# Altium project Ethernet.PrjPCB
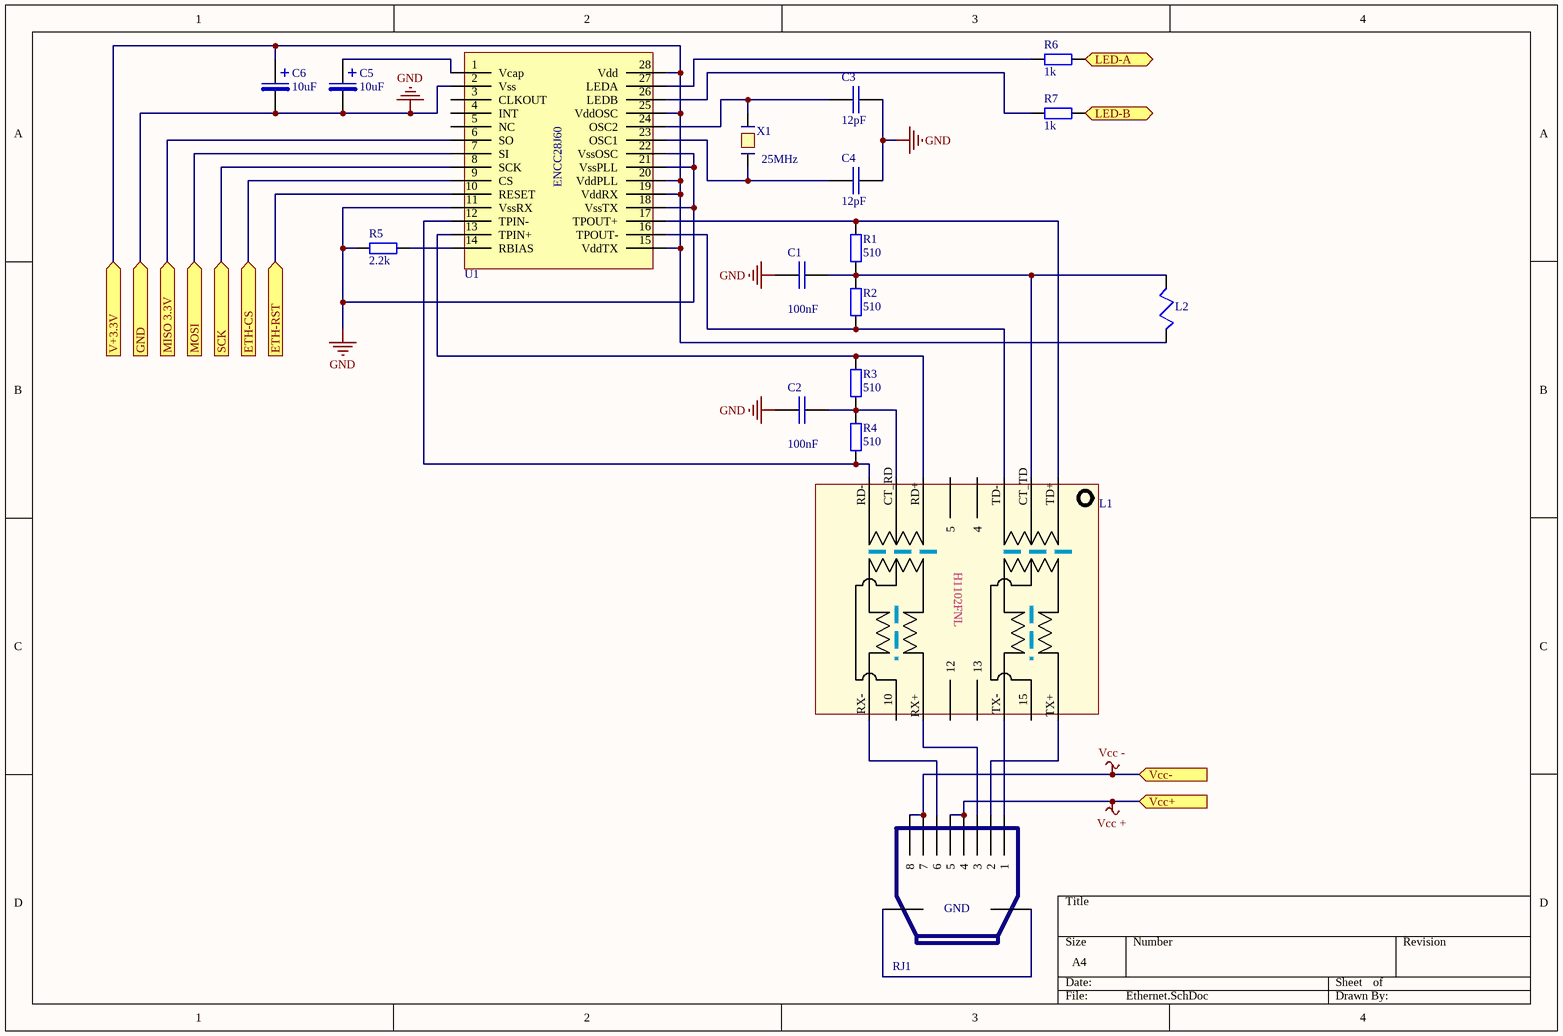
[diagram p0: Ethernet.SchDoc]
1 sheet, 18 parts. Net scope: flat (ports and power ports of the same name join across sheets).
Board file: Ethernet.PcbDoc

## Sheet Ethernet.SchDoc
size A4

### Parts
C1  100nF  [SMD-0805]
C2  100nF  [SMD-0805]
C3  12pF  [SMD-0805]
C4  12pF  [SMD-0805]
C5  10uF  [SMD-0805]
C6  10uF  [SMD-0805]
L1  PULSE H1102FNL  [H1102FNL]  (value not drawn)
L2  FB 200mA  [SMD-0805]  (value not drawn)
R1  510  [SMD-0805]
R2  510  [SMD-0805]
R3  510  [SMD-0805]
R4  510  [SMD-0805]
R5  value 2.2k  [SMD-0805]  (hidden comment: 20K)
R6  1K  [SMD-0805]
R7  1K  [SMD-0805]
RJ1  RJ45GE  [RJ45GE]  (value not drawn)
U1  ENC28J60-I/SO  [SO-28]  (value not drawn)
X1  25MHz  [THT2-488]

### Ports
ETH-CS (in), ETH-RST (in), GND (in), LED-A (in), LED-B (in), MISO 3.3V (in), MOSI (in), SCK (in), V+3.3V (in), Vcc+ (in), Vcc- (in)

### Nets
GND: C1.2 C2.2 C3.1 C4.1 C5.1 C6.1 R5.2 U1.2(Vss) U1.11(VssRX) U1.18(VssTX) U1.21(VssPLL) U1.22(VssOSC) ; port GND
Vcc +: RJ1.4 RJ1.5 ; port Vcc+
Vcc -: RJ1.7 RJ1.8 ; port Vcc-
NetC1_1: C1.1 L1.CT_TD L2.2 R1.2 R2.1
NetC2_1: C2.1 L1.CT_RD R3.2 R4.1
NetC3_2: C3.2 U1.24(OSC2) X1.1(C)
NetC4_2: C4.2 U1.23(OSC1) X1.2(A)
NetC5_2: C5.2 U1.1(Vcap)
NetC6_2: C6.2 L2.1 U1.15(VddTX) U1.19(VddRX) U1.20(VddPLL) U1.25(VddOSC) U1.28(Vdd) ; port V+3.3V
NetL1_RD+: L1.RD+ R3.1 U1.13(TPIN+)
NetL1_RD-: L1.RD- R4.2 U1.12(TPIN-)
NetL1_RX+: L1.RX+ RJ1.3
NetL1_RX-: L1.RX- RJ1.6
NetL1_TD+: L1.TD+ R1.1 U1.17(TPOUT+)
NetL1_TD-: L1.TD- R2.2 U1.16(TPOUT-)
NetL1_TX+: L1.TX+ RJ1.2
NetL1_TX-: L1.TX- RJ1.1
NetR5_1: R5.1 U1.14(RBIAS)
NetR6_1: R6.1 ; port LED-A
NetR6_2: R6.2 U1.27(LEDA)
NetR7_1: R7.1 ; port LED-B
NetR7_2: R7.2 U1.26(LEDB)
NetRJ1_GND-1: RJ1.GND-1 RJ1.GND-2
NetU1_6: U1.6(SO) ; port MISO 3.3V
NetU1_7: U1.7(SI) ; port MOSI
NetU1_8: U1.8(SCK) ; port SCK
NetU1_9: U1.9(CS) ; port ETH-CS
NetU1_10: U1.10(RESET) ; port ETH-RST

Not connected (* = marked no-connect by the designer): L1 4 5 10 12 13 15; U1 3(CLKOUT) 4(INT) 5(NC)

### Notes on the sheet
- (in symbol ENC28J60-I/SO) ENCC28J60
- (in symbol PULSE H1102FNL) H1102FNL
- (in symbol RJ45GE) GND

### Library data of the parts
C1 C2 = C-100nF-0805: Condensator: ceramic; 100nF; 50V; X7R; ±10%; SMD; 0805; -55÷125°C; MinQuantity: 10; Code: AVX 08055C104KAT2A; Cost: 0.031; Link: http://www.tme.eu/ro/details/08055c104kat2a/condensatoare-mlcc-smd-0805/avx/#; Value: 100nF
C3 C4 = C-12pF-0805: Condensator: ceramic; MLCC; 12pF; 50V; C0G; ±5%; SMD; 0805; MinQuantity: 10; Code: CC0805JRNPO9BN120; Cost: 0.033; Link: https://www.tme.eu/ro/details/cc0805jrnpo9120/condensatoare-mlcc-smd-0805/yageo/cc0805jrnpo9bn120/; Value: 12pF
C5 C6 = C-10uF-0805: Condensator: ceramic; 10uF; 16V; X5R; ±10%; SMD; 0805; -55÷125°C; MinQuantity: 10; Code: C0805C106K4PAC; Cost: 0.417; Link: http://www.tme.eu/ro/details/c0805c106k4pac/condensatoare-mlcc-smd-0805/kemet/#; Value: 10uF
L1 = PULSE H1102FNL: Transformer: Ethernet; SMD; Trans: RX 1:1,TX 1:1; -1.1dB; 0÷70°C; Link: https://www.tme.eu/gb/details/h1102fnl/smd-inductors-others/pulse/
L2 = FB 200mA: Ferrite: bead; 150ohm; Mounting: SMD; 200mA; Case:0805; -55÷125°C; MinQuantity: 25; Cost: 1.39; Link: https://www.tme.eu/gb/details/blm21ag151sn1d/ferrite-beads/murata/
R1-R4 = R-510-0805: Rezistor: thick film; SMD; 0805; 510O; 125mW; ±1%; -55÷155°C; MinQuantity: 100; Code: CRCW0805510RFKTABC; Cost: 0.027; Link: http://www.tme.eu/ro/details/crcw0805510rfktabc/rezistente-smd-0805/vishay/#; Value: 510
R5 = R-2.2K-0805: Rezistor: thick film; SMD; 0805; 2,2kO; 0,125W; ±1%; -55÷155°C; MinQuantity: 100; Code: CRCW08052K20FKEA; Cost: 0.023; Link: https://www.tme.eu/ro/details/crcw08052k20fkea/rezistente-smd-0805/vishay/
R6 R7 = R-1K-0805: Rezistor: thick film; SMD; 0805; 1kO; 0,125W; ±5%; -55÷155°C; MinQuantity: 100; Code: RC0805JR-071KL; Cost: 0.027; Link: http://www.tme.eu/ro/details/rc0805jr-071k/rezistente-smd-0805/yageo/rc0805jr-071kl/#; Value: 1k
RJ1 = RJ45GE: Soclu; RJ45; PIN:8; ecranat; Dispunere pini:8p8c; THT
U1 = ENC28J60-I/SO: Controler Ethernet; 10Base-T; SPI; SO28; 3,1÷3,6V; Link: https://www.tme.eu/ro/details/enc28j60-i_so/circuite-integrate-ethernet/microchip-technology/
X1 = YIC 25.00M-HC49-S: Rezonator: de cuart; 25MHz; THT; MinQuantity: 1; Cost: 0.718; Link: https://www.tme.eu/ro/details/25.00m-hc49-s/cristale-de-cuart-tht/yic/